# Altium project PCB_Project1.PrjPCB
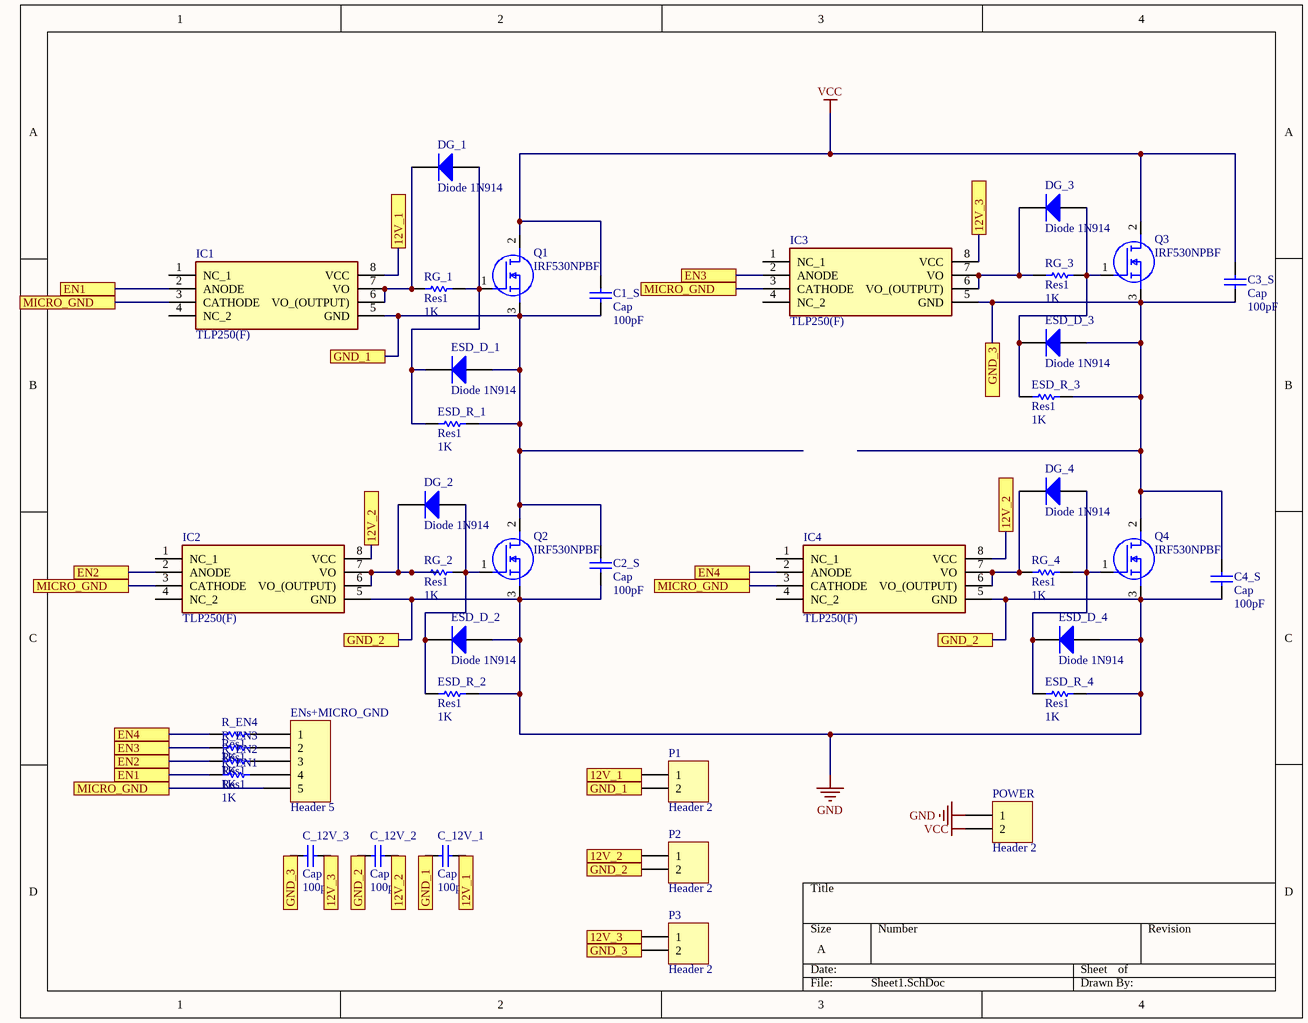
[diagram p0: Sheet1.SchDoc]
1 sheet, 40 parts. Net scope: flat (ports and power ports of the same name join across sheets).
Board file: PCB1.PcbDoc

## Sheet Sheet1.SchDoc
size A

### Parts
C1_S  Cap  value 100pF  [RAD-0.3]
C2_S  Cap  value 100pF  [RAD-0.3]
C3_S  Cap  value 100pF  [RAD-0.3]
C4_S  Cap  value 100pF  [RAD-0.3]
C_12V_1  Cap  value 100pF  [RAD-0.3]
C_12V_2  Cap  value 100pF  [RAD-0.3]
C_12V_3  Cap  value 100pF  [RAD-0.3]
DG_1  Diode 1N914  [DO-35]
DG_2  Diode 1N914  [DO-35]
DG_3  Diode 1N914  [DO-35]
DG_4  Diode 1N914  [DO-35]
ENs+MICRO_GND  Header 5  [HDR1X5]
ESD_D_1  Diode 1N914  [DO-35]
ESD_D_2  Diode 1N914  [DO-35]
ESD_D_3  Diode 1N914  [DO-35]
ESD_D_4  Diode 1N914  [DO-35]
ESD_R_1  Res1  value 1K  [AXIAL-0.3]
ESD_R_2  Res1  value 1K  [AXIAL-0.3]
ESD_R_3  Res1  value 1K  [AXIAL-0.3]
ESD_R_4  Res1  value 1K  [AXIAL-0.3]
IC1  TLP250(F)  [DIP762W60P254L966H485Q8N]
IC2  TLP250(F)  [DIP762W60P254L966H485Q8N]
IC3  TLP250(F)  [DIP762W60P254L966H485Q8N]
IC4  TLP250(F)  [DIP762W60P254L966H485Q8N]
P1  Header 2  [HDR1X2]
P2  Header 2  [HDR1X2]
P3  Header 2  [HDR1X2]
POWER  Header 2  [HDR1X2]
Q1  IRF530NPBF  [TO254P469X1042X1967-3P]
Q2  IRF530NPBF  [TO254P469X1042X1967-3P]
Q3  IRF530NPBF  [TO254P469X1042X1967-3P]
Q4  IRF530NPBF  [TO254P469X1042X1967-3P]
R_EN1  Res1  value 1K  [AXIAL-0.3]
R_EN2  Res1  value 1K  [AXIAL-0.3]
R_EN3  Res1  value 1K  [AXIAL-0.3]
R_EN4  Res1  value 1K  [AXIAL-0.3]
RG_1  Res1  value 1K  [AXIAL-0.3]
RG_2  Res1  value 1K  [AXIAL-0.3]
RG_3  Res1  value 1K  [AXIAL-0.3]
RG_4  Res1  value 1K  [AXIAL-0.3]

### Ports
12V_1, 12V_2, 12V_3, EN1, EN2, EN3, EN4, GND_1, GND_2, GND_3, MICRO_GND

### Nets
GND: C2_S.1 C4_S.1 C_12V_2.1 ESD_D_2.1(A) ESD_D_4.1(A) ESD_R_2.2 ESD_R_4.2 IC2.5(GND) IC4.5(GND) P2.2 POWER.1 Q2.3(S) Q4.3(S) ; port GND_2
VCC: C1_S.2 C3_S.2 POWER.2 Q1.2(D) Q3.2(D)
NetC1_S_1: C1_S.1 C2_S.2 C_12V_1.1 ESD_D_1.1(A) ESD_R_1.2 IC1.5(GND) P1.2 Q1.3(S) Q2.2(D) ; port GND_1
NetC3_S_1: C3_S.1 C4_S.2 C_12V_3.1 ESD_D_3.1(A) ESD_R_3.2 IC3.5(GND) P3.2 Q3.3(S) Q4.2(D) ; port GND_3
NetC_12V_1_2: C_12V_1.2 IC1.8(VCC) P1.1 ; port 12V_1
NetC_12V_2_2: C_12V_2.2 IC2.8(VCC) IC4.8(VCC) P2.1 ; port 12V_2
NetC_12V_3_2: C_12V_3.2 IC3.8(VCC) P3.1 ; port 12V_3
NetDG_1_1: DG_1.1(A) ESD_D_1.2(K) ESD_R_1.1 Q1.1(G) RG_1.2
NetDG_1_2: DG_1.2(K) IC1.6(VO_(OUTPUT)) IC1.7(VO) RG_1.1
NetDG_2_1: DG_2.1(A) ESD_D_2.2(K) ESD_R_2.1 Q2.1(G) RG_2.2
NetDG_2_2: DG_2.2(K) IC2.6(VO_(OUTPUT)) IC2.7(VO) RG_2.1
NetDG_3_1: DG_3.1(A) ESD_D_3.2(K) ESD_R_3.1 Q3.1(G) RG_3.2
NetDG_3_2: DG_3.2(K) IC3.6(VO_(OUTPUT)) IC3.7(VO) RG_3.1
NetDG_4_1: DG_4.1(A) ESD_D_4.2(K) ESD_R_4.1 Q4.1(G) RG_4.2
NetDG_4_2: DG_4.2(K) IC4.6(VO_(OUTPUT)) IC4.7(VO) RG_4.1
NetENs+MICRO_GND_1: ENs+MICRO_GND.1 R_EN4.2
NetENs+MICRO_GND_2: ENs+MICRO_GND.2 R_EN3.2
NetENs+MICRO_GND_3: ENs+MICRO_GND.3 R_EN2.2
NetENs+MICRO_GND_4: ENs+MICRO_GND.4 R_EN1.2
NetENs+MICRO_GND_5: ENs+MICRO_GND.5 IC1.3(CATHODE) IC2.3(CATHODE) IC3.3(CATHODE) IC4.3(CATHODE) ; port MICRO_GND
NetIC1_2: IC1.2(ANODE) R_EN1.1 ; port EN1
NetIC2_2: IC2.2(ANODE) R_EN2.1 ; port EN2
NetIC3_2: IC3.2(ANODE) R_EN3.1 ; port EN3
NetIC4_2: IC4.2(ANODE) R_EN4.1 ; port EN4

Not connected (* = marked no-connect by the designer): IC1 1(NC_1) 4(NC_2); IC2 1(NC_1) 4(NC_2); IC3 1(NC_1) 4(NC_2); IC4 1(NC_1) 4(NC_2)

### Library data of the parts
C1_S C2_S C3_S C4_S C_12V_1-C_12V_3 = Cap: Capacitor; Published: 8-Jun-2000; LatestRevisionDate: 17-Jul-2002; LatestRevisionNote: Re-released for DXP Platform.; PackageReference: RAD-0.3; Publisher: Altium Limited; PackageDescription: Radial Cap, Thru-Hole; 2 Leads; 0.3 in Pin Spacing
DG_1-DG_4 ESD_D_1-ESD_D_4 = Diode 1N914: High Conductance Fast Diode; Published: 8-Jun-2000; LatestRevisionDate: 17-Jul-2002; LatestRevisionNote: Re-released for DXP Platform.; DatasheetVersion: 1997; PackageReference: DO-35; Publisher: Altium Limited; PackageDescription: Diode, Axial; Body 3.8 x 1.9 mm (LxDia. max), Lead Dia. 0.53 mm (max); Code_JEDEC: DO-204-AH; ComponentLink1Description: Manufacturer Link; ComponentLink1URL: http://www.fairchildsemi.com/; ComponentLink2Description: Datasheet; ComponentLink2URL: http://www.fairchildsemi.com/ds/1N%2F1N4448.pdf
ENs+MICRO_GND = Header 5: Header, 5-Pin; LatestRevisionDate: 17-Jul-2002; LatestRevisionNote: Re-released for DXP Platform.; Publisher: Altium Limited
ESD_R_1-ESD_R_4 R_EN1-R_EN4 RG_1-RG_4 = Res1: Resistor; Published: 8-Jun-2000; LatestRevisionDate: 17-Jul-2002; LatestRevisionNote: Re-released for DXP Platform.; PackageReference: AXIAL-0.3; Publisher: Altium Limited; PackageDescription: Axial Device, Thru-Hole; 2 Leads; 0.3 in Pin Spacing
IC1-IC4 = TLP250(F): Integrated Circuit; Manufacturer_Name: Toshiba; Datasheet Link: http://docs-emea.rs-online.com/webdocs/08df/0900766b808dfee1.pdf; Height: 4.85mm; Manufacturer_Part_Number: TLP250(F); Mouser Part Number: 757-TLP250(F); Mouser Price/Stock: https://www.mouser.com/Search/Refine.aspx?Keyword=757-TLP250%28F%29; RS Part Number: 1000151P; RS Price/Stock: http://uk.rs-online.com/web/p/products/1000151P
P1-P3 POWER = Header 2: Header, 2-Pin; LatestRevisionDate: 17-Jul-2002; LatestRevisionNote: Re-released for DXP Platform.; Publisher: Altium Limited
Q1-Q4 = IRF530NPBF: MOSFET (N-Channel); Manufacturer_Name: Infineon; Allied_Number: 70016965; Datasheet Link: https://www.arrow.com/en/products/irf530npbf/infineon-technologies-ag; Height: 4.69mm; Manufacturer_Part_Number: IRF530NPBF; Mouser Part Number: 942-IRF530NPBF; Mouser Price/Stock: https://www.mouser.com/Search/Refine.aspx?Keyword=942-IRF530NPBF; RS Part Number: 5410755P; RS Price/Stock: http://uk.rs-online.com/web/p/products/5410755P; Allied Price/Stock: https://www.alliedelec.com/infineon-irf530npbf/70016965/